# Altium schematic sheet Rpi Connections.SchDoc
size A4; SheetNumber: 2; SheetTotal: 5
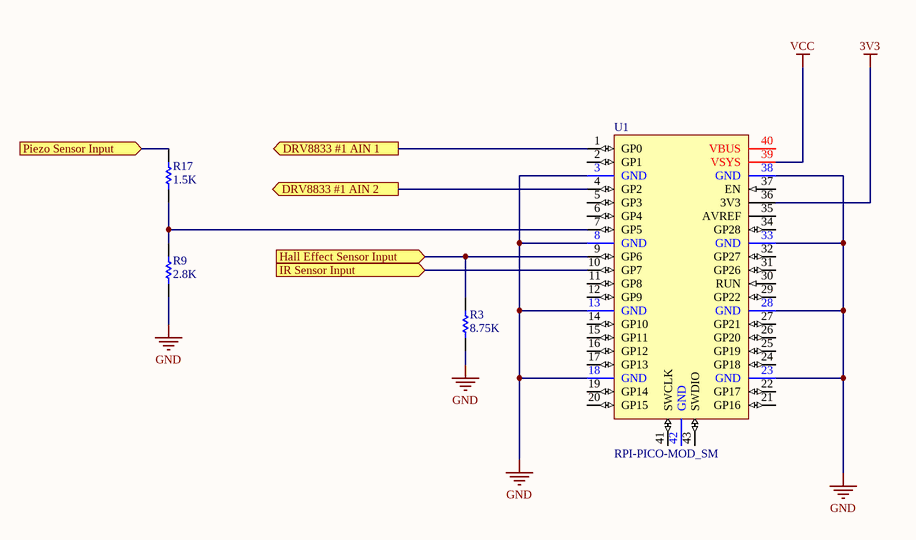
[diagram p0: Rpi Connections.SchDoc]

## Parts
R3  value 8.75K  (hidden comment: Resistor)
R9  value 2.8K  (hidden comment: Resistor)
R17  value 1.5K  (hidden comment: Resistor)
U1  RPI-PICO-MOD_SM  [RPI-PICO-MOD]

## Ports
DRV8833 #1 AIN 1 (out), DRV8833 #1 AIN 2 (out), Hall Effect Sensor Input (in), IR Sensor Input (in), Piezo Sensor Input (in)

## Nets
3V3: U1.36(3V3)
GND: R3.1 R9.1 U1.3(GND) U1.8(GND) U1.13(GND) U1.18(GND) U1.23(GND) U1.28(GND) U1.33(GND) U1.38(GND)
VCC: U1.39(VSYS)
DRV8833 #1 AIN 1: U1.1(GP0) ; port DRV8833 #1 AIN 1
DRV8833 #1 AIN 2: U1.4(GP2) ; port DRV8833 #1 AIN 2
Hall Effect Sensor Input: R3.2 U1.9(GP6) ; port Hall Effect Sensor Input
IR Sensor Input: U1.10(GP7) ; port IR Sensor Input
Piezo Sensor Input: R17.2 ; port Piezo Sensor Input
NetR9_2: R9.2 R17.1 U1.7(GP5)

Not connected (* = marked no-connect by the designer): U1 2(GP1) 5(GP3) 6(GP4) 11(GP8) 12(GP9) 14(GP10) 15(GP11) 16(GP12) 17(GP13) 19(GP14) 20(GP15) 21(GP16) 22(GP17) 24(GP18) 25(GP19) 26(GP20) 27(GP21) 29(GP22) 30(RUN) 31(GP26) 32(GP27) 34(GP28) 35(AVREF) 37(EN) 40(VBUS) 41(SWCLK) 42(GND) 43(SWDIO)

## Library data of the parts
R3 R9 R17 = Resistor: TC1: 0; SimulationGenericComponent: True; TC2: 0
U1 = RPI-PICO-MOD_SM: RASPBERRY PI PICO RP2040 BOARD NO TEST PADS; Manufacturer: Raspberry Pi Foundation; Manufacturer Part No: SC0915; Mounting Technology: SMT; Supplier: DigiKey; Supplier Part No: 2648-SC0915CT-ND; Supplier Link: https://www.digikey.com/en/products/detail/raspberry-pi/SC0915/13684020